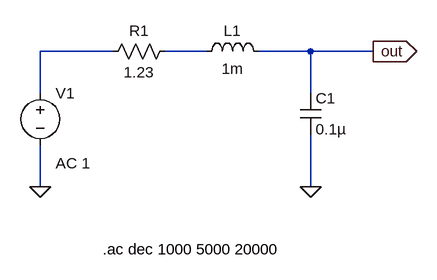
[diagram p0: schematic Filtro LC.asc]
Filtro LC.asc, the LTspice schematic file:
Version 4
SHEET 1 880 680
WIRE 192 32 80 32
WIRE 336 32 272 32
WIRE 496 32 416 32
WIRE 592 32 496 32
WIRE 80 96 80 32
WIRE 496 96 496 32
WIRE 80 240 80 176
WIRE 496 240 496 160
FLAG 80 240 0
FLAG 496 240 0
FLAG 592 32 out
IOPIN 592 32 Out
SYMBOL voltage 80 80 R0
WINDOW 123 24 124 Left 2
WINDOW 39 0 0 Left 0
SYMATTR InstName V1
SYMATTR Value ""
SYMATTR Value2 AC 1
SYMBOL res 288 16 R90
WINDOW 0 0 56 VBottom 2
WINDOW 3 32 56 VTop 2
SYMATTR InstName R1
SYMATTR Value 1.23
SYMBOL ind 320 48 R270
WINDOW 0 32 56 VTop 2
WINDOW 3 5 56 VBottom 2
SYMATTR InstName L1
SYMATTR Value 1m
SYMBOL cap 480 96 R0
SYMATTR InstName C1
SYMATTR Value 0.1µ
TEXT 176 336 Left 2 !.ac dec 1000 5000 20000

The netlist it stands for:
* Filtro LC.asc
V1 N001 0 AC 1
R1 N002 N001 1.23
L1 N002 out 1m
C1 out 0 0.1µ
.ac dec 1000 5000 20000
.backanno
.end